# EAGLE design lcheapo-v4 (EAGLE 7.5.0)
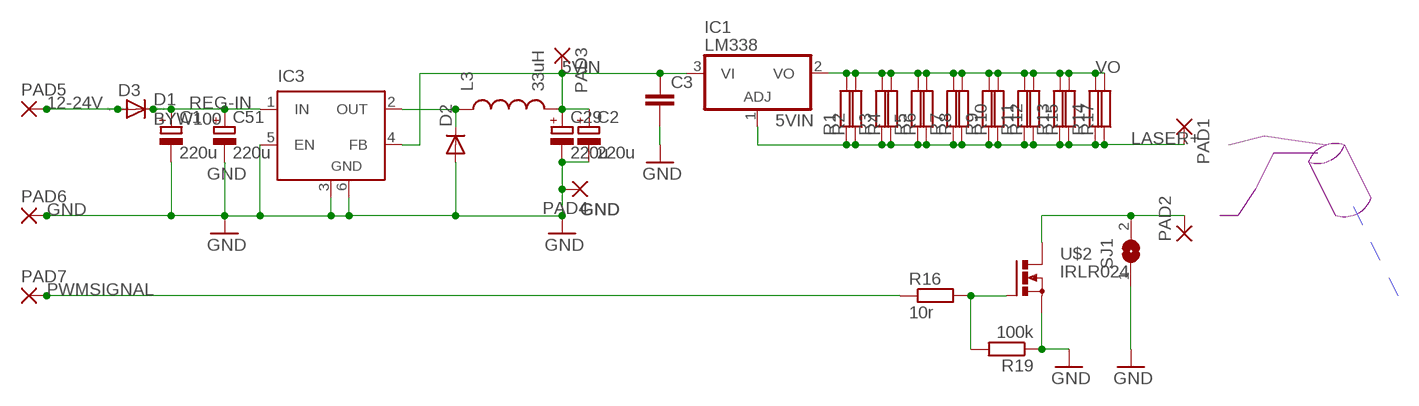
[diagram p0: schematic, sheet 1]

## Parts
C1  220u  CPOL-EUE2.5-7  [E2,5-7]
C2  220u  CPOL-EUD  [PANASONIC_D]
C3  C-EUC0603  [C0603]
C29  220u  CPOL-EUE2.5-7  [E2,5-7]
C51  220u  CPOL-EUD  [PANASONIC_D]
D1  BYW100  [F126-10]
D2  DIODE-DO-214AC  [DO-214AC]
D3  D-SOD-87  [SOD87]
IC1  LM338  317T  [TO220H]
IC3  LM2596S  [TO263-5]
L3  33uH  INDUCTORPWR  [CDRH125]
PAD1  2,54/1,0  [2,54/1,0]
PAD2  2,54/1,0  [2,54/1,0]
PAD3  2,54/1,0  [2,54/1,0]
PAD4  2,54/1,0  [2,54/1,0]
PAD5  3,17/1,3  [3,17/1,3]
PAD6  3,17/1,3  [3,17/1,3]
PAD7  2,54/1,0  [2,54/1,0]
R1  R-EU_R2512  [R2512]
R2  R-EU_0411/3V  [0411V]
R3  R-EU_R2512  [R2512]
R4  R-EU_0411/3V  [0411V]
R5  R-EU_R2512  [R2512]
R6  R-EU_0411/3V  [0411V]
R7  R-EU_R2512  [R2512]
R8  R-EU_0411/3V  [0411V]
R9  R-EU_R2512  [R2512]
R10  R-EU_0411/3V  [0411V]
R11  R-EU_R2512  [R2512]
R12  R-EU_0411/3V  [0411V]
R13  R-EU_R2512  [R2512]
R14  R-EU_R2512  [R2512]
R15  R-EU_0411/3V  [0411V]
R16  10r  R-EU_R0603  [R0603]
R17  R-EU_0411/3V  [0411V]
R19  100k  R-EU_R0603  [R0603]
SJ1  SJ  [SJ]
U$2  IRLR024  N-POWER-MOSFETDPAK-MOSFET  [D-PAK_TO252AA]

## Nets
2OUT: PAD2.1(P) SJ1.2 U$2.4(D)
5VIN: C2.+ C3.1 C29.+ IC1.3(VI) IC3.4(FB) L3.2 PAD3.1(P)
12-24V: D1.A D3.2(A) PAD5.1(P)
GND: C1.- C2.- C3.2 C29.- C51.- D2.2(A) IC3.3(GND) IC3.5(EN) IC3.6(GND) PAD4.1(P) PAD6.1(P) R19.1 SJ1.1 U$2.3(S)
LASER+: IC1.1(ADJ) PAD1.1(P) R1.1 R2.1 R3.1 R4.1 R5.1 R6.1 R7.1 R8.1 R9.1 R10.1 R11.1 R12.1 R13.1 R14.1 R15.1 R17.1
N$20: R16.2 R19.2 U$2.1(G)
N$50: D2.1(C) IC3.2(OUT) L3.1
PWMSIGNAL: PAD7.1(P) R16.1
REG-IN: C1.+ C51.+ D1.C D3.1(C) IC3.1(IN)
VO: IC1.2(VO) R1.2 R2.2 R3.2 R4.2 R5.2 R6.2 R7.2 R8.2 R9.2 R10.2 R11.2 R12.2 R13.2 R14.2 R15.2 R17.2

## Library data of the parts
C1 C2 C29 C51 = rcl:CPOL-EU: POLARIZED CAPACITOR, European symbol
C3 = rcl:C-EU: CAPACITOR, European symbol
D1 = diode:BYW100: DIODE high-efficiency fast rectifier (ST)
D2 = dp_devices:DIODE: Various Diode Packages
D3 = semicon-smd-ipc:D-: DIODE unfilled
IC1 = linear:*317: Positive VOLTAGE REGULATOR
IC3 = linear:LM2596S: STEP-DOWN VOLTAGE REGULATOR
L3 = SparkFun-Passives:INDUCTOR: Inductors Basic Inductor/Choke - 0603 and 1206. Footprints are not proven and vary greatly between part numbers. SRN6045- 33uH, 20% 1.4A SDR0403-560KL - 56uH, 10%, 500mA RMS/740mA peak
PAD1-PAD4 PAD7 = wirepad:2,54/1,0: THROUGH-HOLE PAD
PAD5 PAD6 = wirepad:3,17/1,3: THROUGH-HOLE PAD
R1-R17 R19 = resistor:R-EU_: RESISTOR, European symbol
SJ1 = jumper:SJ: SMD solder JUMPER
U$2 = Cohesion_parts:N-POWER-MOSFET

## Board
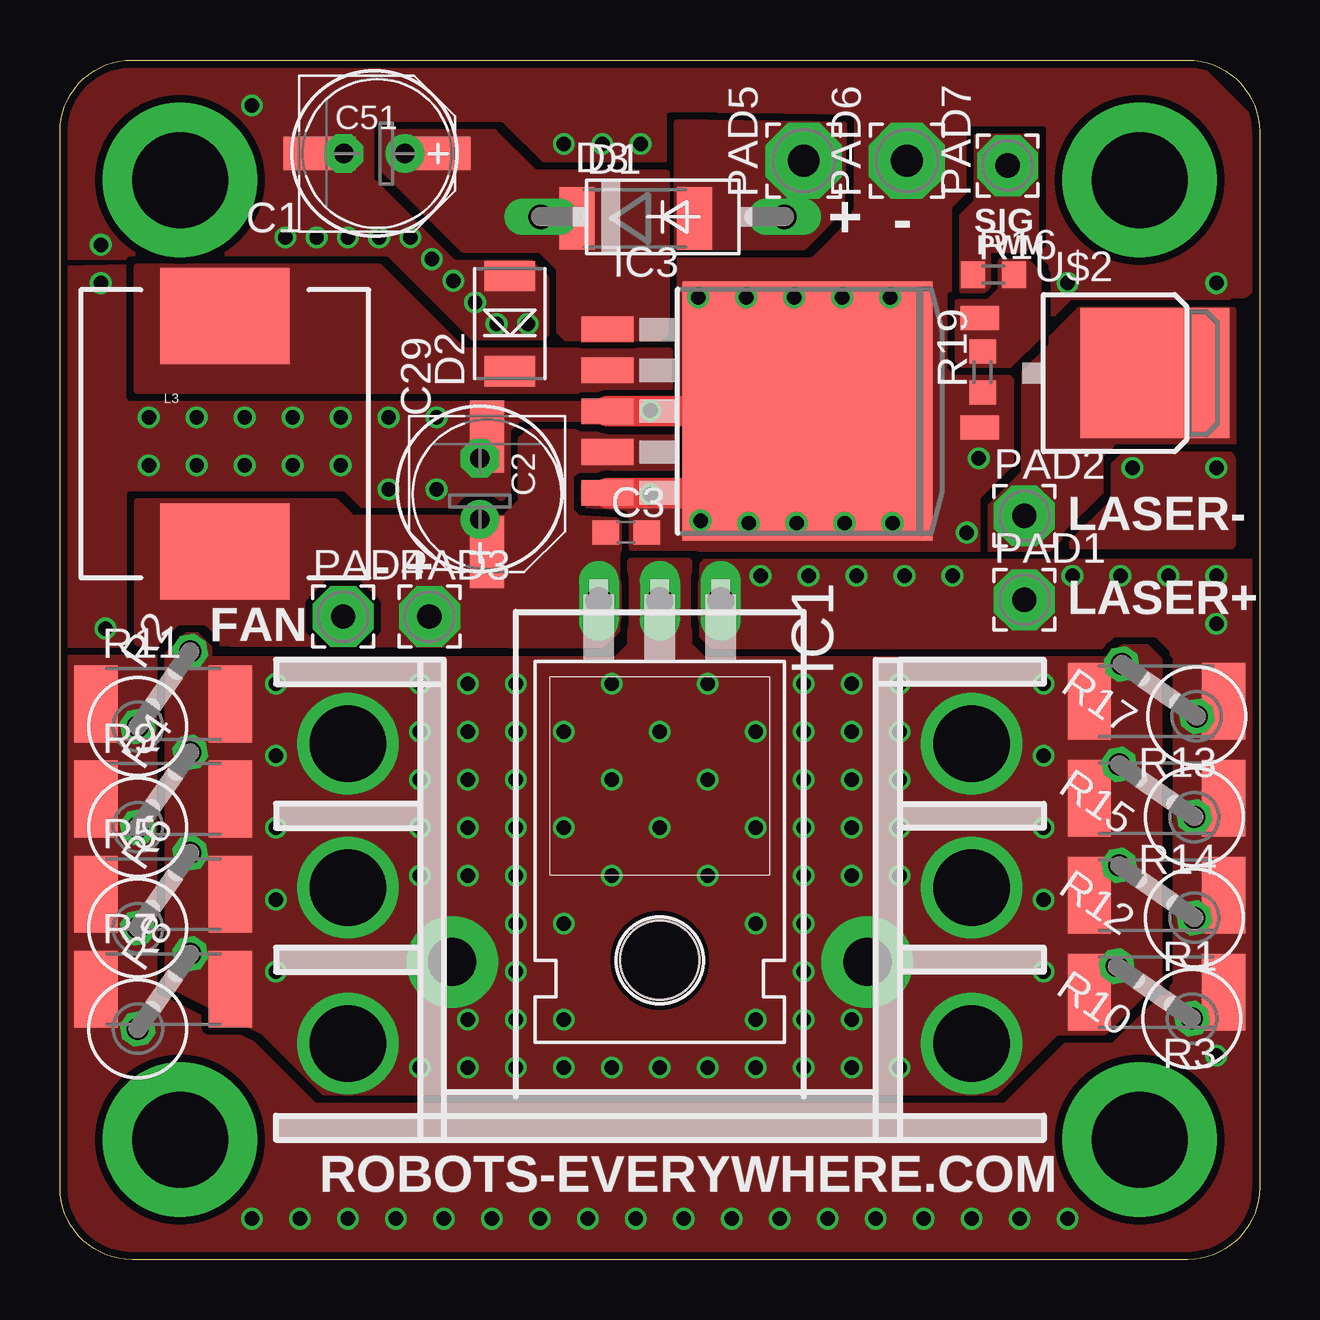
[diagram p1: board, top side]
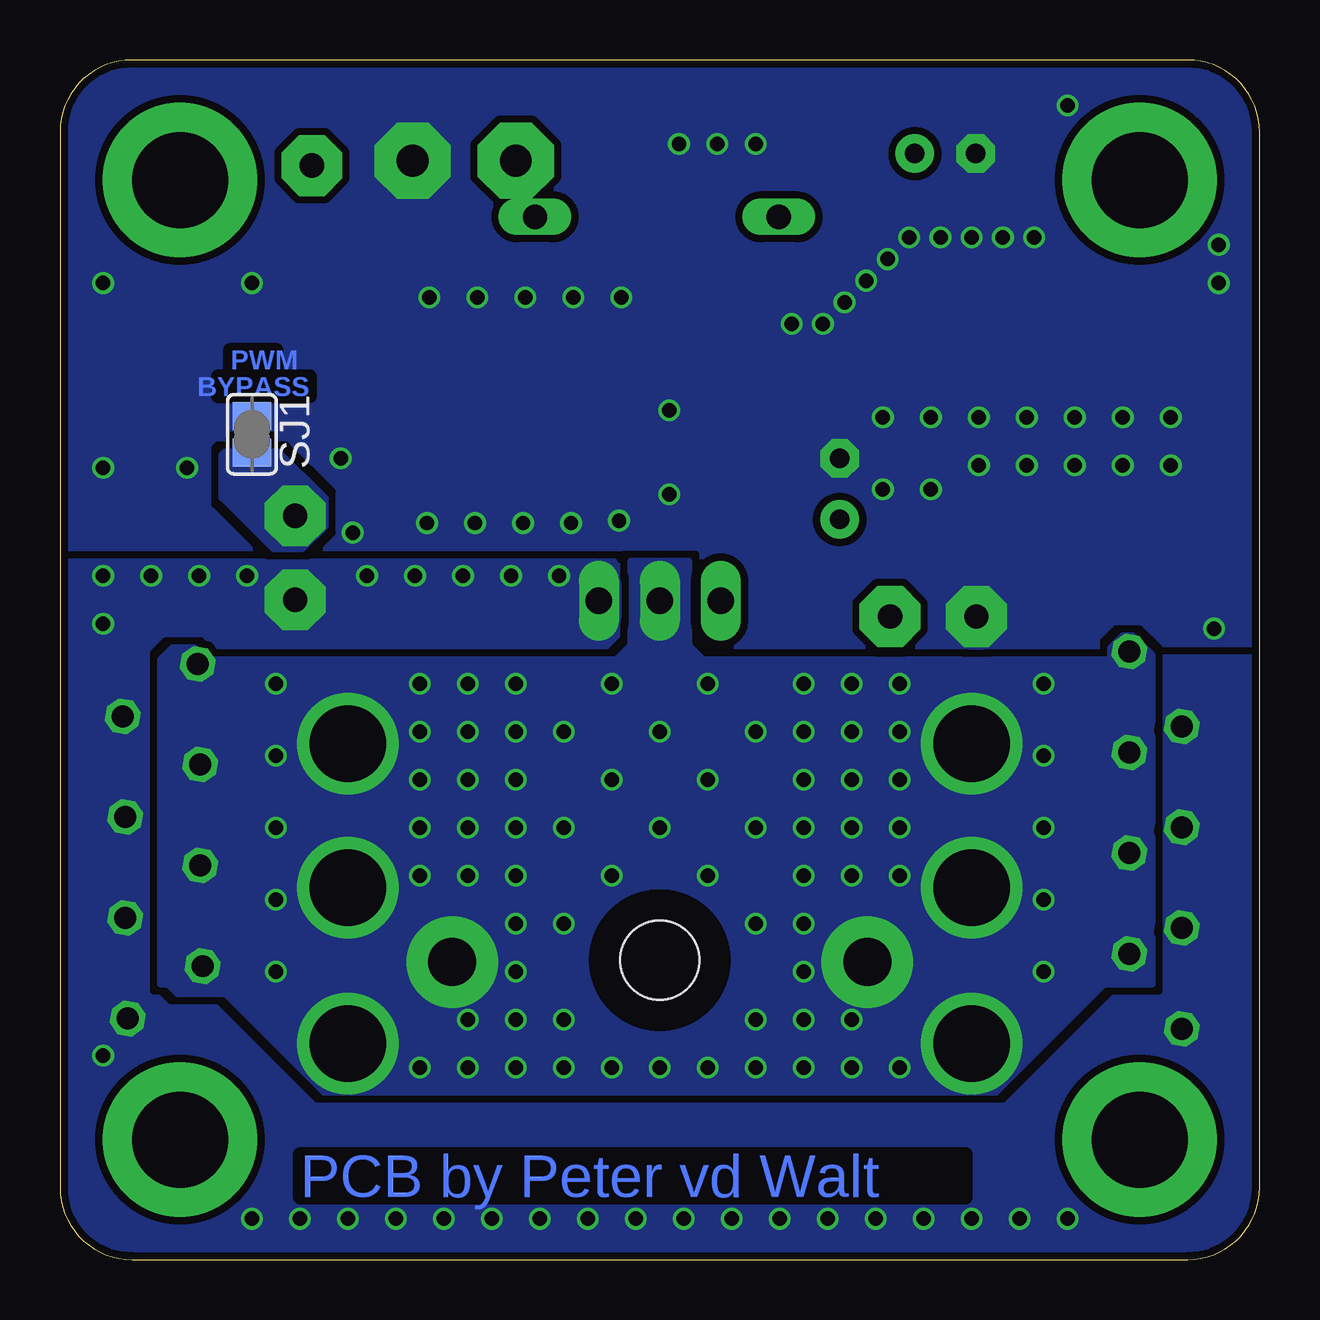
[diagram p2: board, bottom side, seen from below]

Size 50 x 50 mm. Coordinates in mm from the lower left corner, seen from the top.
Outline: 3,0 arc-90 0,3 0,47 arc-90 3,50 47,50 arc-90 50,47 50,3 arc-90 47,0 3,0
Copper layers (1*16): Top 0.035mm / dielectric 1.5mm / Bottom 0.035mm
Design rules "dirt_cheap_dirty_boards.v1": minimum track width 5mil, minimum drill 12mil, track to track 5mil, track to pad 5mil, pad to pad 5mil, via to via 5mil, smd to smd 0mil, copper to edge 10mil, drill to drill 10mil, minimum pad ring 10mil, minimum via ring 6mil, stop-mask expansion 2mil, vias tented up to drill 25mil, thermal gap 10mil

### Footprints (pad centres in the part's own frame; a part is rotated, then mirrored left to right if it is on the bottom)
E2,5-7 = drill 0.813 pad 1.6: + -1.27,0 | drill 0.813 pad 1.6 octagon: - 1.27,0
PANASONIC_D = smd 3 x 1.4: + 2.4,0; - -2.4,0
C0603 = smd 1.1 x 1: 1 -0.85,0; 2 0.85,0
F126-10 = drill 1.016 long: A 5.08,0; C -5.08,0
DO-214AC = smd 1.27 x 2.1: 1 -1.98,0; 2 1.98,0
SOD87 = smd 1.45 x 2.6: 1 -2.445,0; 2 2.445,0
TO220H = drill 1.118 long: 1 -2.54,-10.16; 2 0,-10.16; 3 2.54,-10.16 | hole 3.302: 0,4.826
TO263-5 = smd 1.067 x 2.159: 1 -3.404,-5.791; 2 -1.702,-5.791; 3 0,-5.791; 4 1.702,-5.791; 5 3.404,-5.791 | smd 10.8 x 10.41: 6 0,2.54
CDRH125 = smd 5.4 x 4: 1 0,4.9; 2 0,-4.9
2,54/1,0 = drill 1.016 pad 2.54 octagon: 1 0,0
3,17/1,3 = drill 1.321 pad 3.175 octagon: 1 0,0
R2512 = smd 1.8 x 3.2: 1 -2.8,0; 2 2.8,0
0411V = drill 0.914 octagon: 1 -2.54,0; 2 1.27,0
R0603 = smd 1 x 1.1: 1 -0.85,0; 2 0.85,0
SJ = smd 1.168 x 1.6: 1 -0.762,0; 2 0.762,0
D-PAK_TO252AA = smd 1 x 1.6: 1 -2.28,-4.8; 3 2.28,-4.8 | smd 5.4 x 6.2: 4 0,2.5

### Placement (x,y rotation side)
C1  13.1,46.1 180 top
C2  17.8,31.9 270 top
C3  23.6,30.3 0 top
C29  17.5,32.12 90 top
C51  13.22,46.1 0 top
D1  25.12,43.46 0 top
D2  18.75,39.01 90 top
D3  24,43.4 0 top
IC1  25,17.3 180 top
IC3  28.62,35.36 270 top
L3  6.87,34.42 0 top
PAD1  40.2,27.5 0 top
PAD2  40.2,31 0 top
PAD3  15.4,26.8 0 top
PAD4  11.8,26.8 0 top
PAD5  31,45.8 90 top
PAD6  35.3,45.8 90 top
PAD7  39.5,45.6 90 top
R1  45.7,15.19 180 top
R2  4.7,24.3 55 top
R3  45.7,11.15 180 top
R4  4.7,20.1 55 top
R5  4.3,15.23 0 top
R6  4.7,15.9 55 top
R7  4.3,11.27 0 top
R8  4.7,11.7 55 top
R9  4.3,19.2 0 top
R10  45.1,11.5 145 top
R11  4.3,23.16 0 top
R12  45.2,15.7 145 top
R13  45.7,23.27 180 top
R14  45.7,19.23 180 top
R15  45.2,19.9 145 top
R16  38.91,41.05 0 top
R17  45.3,24.1 145 top
R19  38.45,36.99 90 top
SJ1  42,34.4 270 bottom
U$2  43.14,36.95 270 top

### Tracks (layer width: path | path; a pad name or v marks a point on that pad's centre or on a via)
2OUT
  pour Top (isolate 0.305, rank 5, no thermals): 38.8,29.5 38.8,31.4 40.2,32.8 40.2,37.3 42.5,39.6 48.9,39.6 48.9,34 44.2,34 43.5,33.3 43.5,31.9 41.1,29.5
  pour Bottom (no thermals): 39,30.6 39,31.7 40.9,33.6 43.1,33.6 43.2,33.5 43.2,31.8 41.1,29.7 39.9,29.7
5VIN
  pour Top (isolate 0.305, rank 3, no thermals): 25.6,34.5 19.5,34.5 19.2,34.2 19.2,31.6 18.5,30.9 12.2,30.9 11.5,31.6 3.2,31.6 3.2,25.7 22.6,25.6 23.3,26.3 23.3,30.7 23.2,30.8 21.6,30.9 21.3,31.2 21.3,32.7 21.4,32.8 25.6,32.8
12-24V
  pour Top (rank 5, no thermals): 25.7,42.2 31,42.2 32.6,43.8 32.7,47.3 25.7,47.4
GND  (via drill 0.6)
  Top 1.27: IC3.3 IC3.6 31.16,31.96 IC3.5
  other vias: 15.7,32.1 15.5,41.7 16.4,40.8 17.3,39.9 18.2,39 19.5,39 14.6,42.6 13.3,42.6 12,42.6 10.7,42.6 9.4,42.6 26.7,30.8 26.6,40.1 28.6,40.1 30.6,40.1 32.6,40.1 34.6,40.1 28.7,30.7 30.7,30.7 32.7,30.7 34.7,30.7 13.7,32.1 15.7,35.1 13.7,35.1 11.7,35.1 9.7,35.1 7.7,35.1 11.7,33.1 9.7,33.1 7.7,33.1 5.7,33.1 5.7,35.1 3.7,35.1 3.7,33.1 24.2,46.5 22.6,46.5 21,46.5 42,40.7 48.2,40.7 8,48.1 1.7,42.3 37.8,30.3 1.7,40.7 1.9,26.3 48.2,33 44.7,33 38.3,33.4 24.6,35.4 24.6,31.9
  pour Top (isolate 0.305, rank 6, no thermals): 4.8,32 11.7,32 12.4,31.3 18.4,31.3 18.8,31.7 18.8,34.4 19.3,34.9 26.1,34.9 26.2,34.8 26.2,32.8 25.9,32.5 21.8,32.5 21.7,32.4 21.7,31.4 21.8,31.3 23.5,31.3 23.8,31 23.8,29.7 23.9,29.6 26.7,29.6 38.4,29.5 38.4,31.6 39.8,33 39.8,36.5 39.4,36.9 37.5,36.9 37,37.4 37,40.1 37.2,40.4 37.2,43.7 37.8,44.3 37.8,47.2 41.2,47.2 41.2,42.6 40.6,42 41.4,41.2 41.4,39 42.4,40 48.6,40 48.8,40.2 49.4,40.2 49.8,40.6 49.8,47.4 47.4,49.8 2,49.8 0,47.8 0,42 0.2,41.8 13.5,41.8 17,38.4 20.1,38.4 20.4,38.7 20.4,41.1 19.9,41.6 16.7,41.6 13.1,45.2 13.1,47.4 18.5,47.4 20,45.8 25.3,45.8 25.3,47.7 33,47.7 33.2,47.5 33.2,43.7 31.2,41.7 25.7,41.7 25.7,36 25.6,35.9 5,35.9 4.8,36.1 4.8,41.4 0.1,41.3 0.1,25.5 4.8,25.5
  pour Bottom (isolate 0.305, rank 6, no thermals): 0.1,49.9 49.9,49.9 49.9,0.1 0.1,0.1
  pour Top: 42.2,29.8 44,31.6 44,33.1 44.4,33.5 48.7,33.5 48.8,33.4 48.8,29.8
LASER+  (via drill 0.6)
  other vias: 29.2,28.5 31.2,28.5 33.2,28.5 35.2,28.5 37.2,28.5 44.2,28.5 46.2,28.5 48.2,28.5 42.2,28.5 48.2,26.5 48.2,8.5 40,1.7 38,1.7 36,1.7 34,1.7 32,1.7 30,1.7 28,1.7 26,1.7 24,1.7 22,1.7 20,1.7 18,1.7 16,1.7 14,1.7 12,1.7 10,1.7 8,1.7 42,1.7
  pour Top (isolate 0.305, rank 2, no thermals): 4.1,25.1 4.1,11.2 8.3,9 10.8,6.5 39.1,6.5 41.7,9.1 44.1,9.1 46.5,11.5 46.5,25.1 46.2,25.4 27,25.4 26.6,25.8 26.6,28.8 26.9,29.1 49.9,29.1 49.9,0.2 49.8,0.1 0.3,0.1 0.1,0.3 0.1,25.1
  pour Bottom (isolate 0.305, rank 2, no thermals): 4.1,25.1 4.1,11.2 6.1,11.2 10.8,6.5 39.1,6.5 43.5,10.9 45.4,10.9 46.2,11.7 46.2,25.4 27,25.4 26.6,25.8 26.6,28.8 26.9,29.1 49.9,29.1 49.9,0.2 49.8,0.1 0.3,0.1 0.1,0.3 0.1,25.1
N$3  (via drill 4 pad 6.45)
  other vias: 5,5
N$4  (via drill 4 pad 6.45)
  other vias: 45,5
N$5  (via drill 4 pad 6.45)
  other vias: 45,45
N$6  (via drill 4 pad 6.45)
  other vias: 5,45
N$20
  pour Top (no thermals): 37.6,37.3 39.6,37.3 40.8,38.5 40.8,41.1 40.3,41.6 39.2,41.6 39.2,40.4 38.7,39.9 37.4,39.9 37.4,37.5
N$50
  pour Top (isolate 0.254, rank 4, no thermals): 3.2,41.4 13.3,41.4 16.8,37.9 25.4,37.9 25.4,36.2 3.2,36.2
PWMSIGNAL
  pour Top (no thermals): 40.7,46.8 38.2,46.8 38.2,44.1 37.6,43.5 37.6,40.4 38.5,40.4 38.7,40.6 38.7,42.1 40.2,42.1 40.7,42.6
REG-IN
  pour Top (isolate 0.305, no thermals): 13.5,47 13.5,45.4 16.8,42.1 20,42.1 20.8,41.3 20.8,38.7 21.1,38.4 25,38.4 25.3,38.7 25.3,45.3 19.8,45.3 18.1,47
VO  (via drill 0.6, 2 pad 3.81, 3.2)
  other vias: 12,21.5 12,15.5 12,9 38,9 38,15.5 38,21.5 33.65,12.4 16.35,12.4 19,24 19,22 19,20 19,18 19,16 19,14 19,12 19,10 19,8 21,8 23,8 25,8 27,8 29,8 31,8 31,10 31,12 31,14 31,16 31,18 31,20 31,22 31,24 25,22 21,18 29,18 25,18 29,10 21,10 29,14 21,14 27,16 23,16 29,22 21,22 27,24 23,24 27,20 23,20 17,24 17,22 17,20 17,18 17,16 33,16 33,18 33,20 33,22 33,24 35,22 35,20 35,18 35,16 15,16 15,18 15,20 9,15 41,15 17,8 15,8 33,8 35,8 33,10 17,10 35,24 15,24 15,22 9,21 41,21 9,24 41,24 41,18 41,12 9,12 9,18
  pour Top (isolate 0.406, no thermals): 6.2,25 23.2,25 23.8,25.6 23.8,29.1 26.2,29.1 26.2,25.6 26.8,25 43.8,25 44.3,25.5 45.3,25.5 45.8,25 45.8,11.5 45.5,11.5 43.5,9.5 41.5,9.5 39,7 11,7 8.5,9.5 4.5,11.5 4.5,25.2 5.3,26 5.7,26 6.2,25.5
  pour Bottom (isolate 0.406, no thermals): 6.2,25 23.2,25 23.8,25.6 23.8,29.1 26.2,29.1 26.2,25.6 26.8,25 43.9,25 44.4,25.5 45.3,25.5 45.8,25 45.8,11.5 45.5,11.5 45.1,11.1 43.1,11.1 39,7 11,7 6.5,11.5 4.5,11.5 4.5,25.2 5.3,26 5.7,26 6.2,25.5

### Text on the board
Bottom: BYPASS | PWM | PCB by Peter vd Walt
tPlace: + | SIG | - | PWM | LASER- | - | + | FAN | LASER+ | ROBOTS-EVERYWHERE.COM